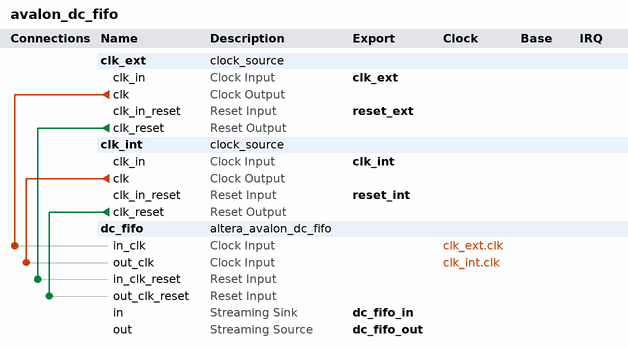
[diagram p0: system contents]
# Platform Designer (Qsys) system avalon_dc_fifo, Arria V 5ASTMD3E3F31I3
# Parameters at their usual value, and those the tool derives, are not listed.
package require -exact qsys 14.0
create_system avalon_dc_fifo
set_project_property DEVICE_FAMILY {Arria V}
set_project_property DEVICE 5ASTMD3E3F31I3

add_instance clk_ext clock_source 14.0
set_instance_parameter_value clk_ext clockFrequency 50000000
set_instance_parameter_value clk_ext clockFrequencyKnown false

add_instance clk_int clock_source 14.0
set_instance_parameter_value clk_int clockFrequency 50000000
set_instance_parameter_value clk_int clockFrequencyKnown false

add_instance dc_fifo altera_avalon_dc_fifo 14.0
set_instance_parameter_value dc_fifo SYMBOLS_PER_BEAT 8
set_instance_parameter_value dc_fifo BITS_PER_SYMBOL 8
set_instance_parameter_value dc_fifo FIFO_DEPTH 512
set_instance_parameter_value dc_fifo USE_PACKETS 0
set_instance_parameter_value dc_fifo WR_SYNC_DEPTH 2
set_instance_parameter_value dc_fifo RD_SYNC_DEPTH 2

# connections
add_connection clk_ext.clk dc_fifo.in_clk clock
add_connection clk_int.clk dc_fifo.out_clk clock
add_connection clk_ext.clk_reset dc_fifo.in_clk_reset reset
add_connection clk_int.clk_reset dc_fifo.out_clk_reset reset

# exported interfaces
add_interface reset_ext reset sink
set_interface_property reset_ext EXPORT_OF clk_ext.clk_in_reset
add_interface clk_int clock sink
set_interface_property clk_int EXPORT_OF clk_int.clk_in
add_interface reset_int reset sink
set_interface_property reset_int EXPORT_OF clk_int.clk_in_reset
add_interface clk_ext clock sink
set_interface_property clk_ext EXPORT_OF clk_ext.clk_in
add_interface dc_fifo_in avalon_streaming sink
set_interface_property dc_fifo_in EXPORT_OF dc_fifo.in
add_interface dc_fifo_out avalon_streaming source
set_interface_property dc_fifo_out EXPORT_OF dc_fifo.out

set_interconnect_requirement {$system} qsys_mm.clockCrossingAdapter HANDSHAKE
set_interconnect_requirement {$system} qsys_mm.maxAdditionalLatency 1
set_interconnect_requirement {$system} qsys_mm.insertDefaultSlave FALSE

save_system avalon_dc_fifo.qsys
